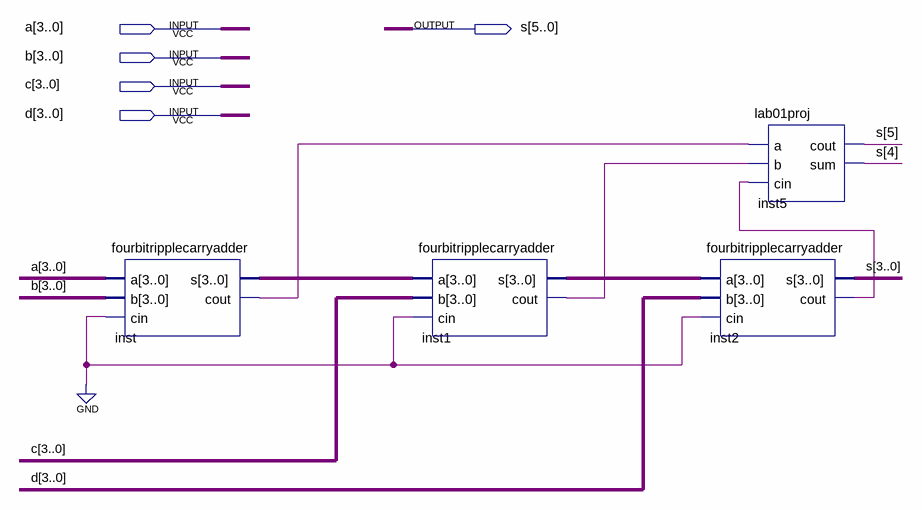
[diagram p0: schematic sheet]
// Quartus schematic fourfourbitcarryadders.bdf as structural Verilog: 4 symbols, 5 pins
module fourfourbitcarryadders (
  input  [3:0] a,
  input  [3:0] b,
  input  [3:0] c,
  input  [3:0] d,
  output [5:0] s
);

  wire inst1_cout, inst2_cout, inst_cout;
  wire [3:0] inst1_s, inst_s;

  fourbitripplecarryadder inst (.a(a), .b(b), .cin(1'b0), .s(inst_s), .cout(inst_cout));
  fourbitripplecarryadder inst1 (.a(inst_s), .b(c), .cin(1'b0), .s(inst1_s), .cout(inst1_cout));
  lab01proj inst5 (.a(inst_cout), .b(inst1_cout), .cin(inst2_cout), .cout(s[5]), .sum(s[4]));
  fourbitripplecarryadder inst2 (.a(inst1_s), .b(d), .cin(1'b0), .s(s[3:0]), .cout(inst2_cout));
endmodule
